# Altium schematic sheet TU_MCU.SchDoc
size 500 x 500 mm
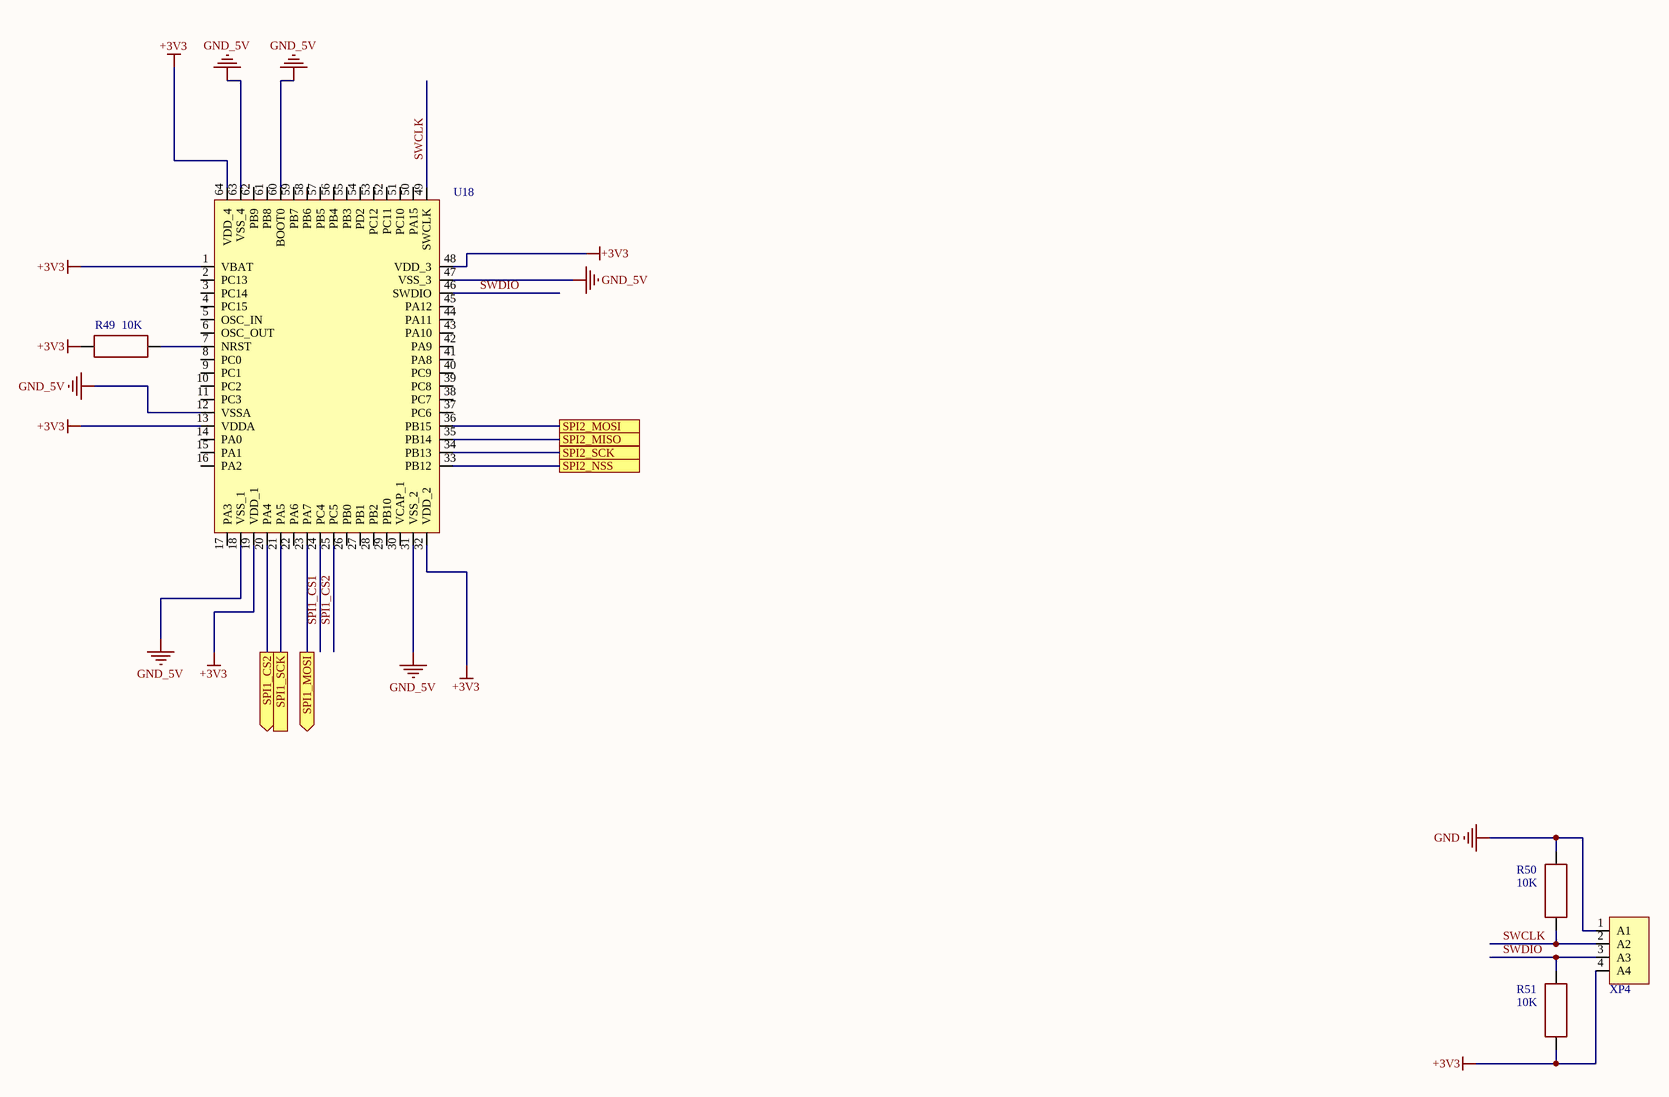
[diagram p0: TU_MCU.SchDoc]

## Parts
R49  value 10K  [RES: 0402]
R50  value 10K  [RES: 0402]
R51  value 10K  [RES: 0402]
U18  STM32F413RGT6  [LQFP-64]  (value not drawn)
XP4  PLS-6 (DS1021-1x6)  [PLS-4 (DS1021-1x4)]  (value not drawn)

## Ports
SPI1_CS2 (out), SPI1_MOSI (out), SPI1_SCK, SPI2_MISO, SPI2_MOSI, SPI2_NSS, SPI2_SCK

## Nets
+3V3: R49.1 R51.2 U18.1(VBAT) U18.13(VDDA) U18.19(VDD_1) U18.32(VDD_2) U18.48(VDD_3) U18.64(VDD_4) XP4.4(A4)
GND: R50.1 XP4.1(A1)
GND_5V: U18.12(VSSA) U18.18(VSS_1) U18.31(VSS_2) U18.47(VSS_3) U18.60(BOOT0) U18.63(VSS_4)
SPI1_CS1: U18.24(PC4)
SPI1_CS2: U18.20(PA4) ; port SPI1_CS2
SPI1_CS2: U18.25(PC5)  [a separate net that carries the same name]
SPI1_MOSI: U18.23(PA7) ; port SPI1_MOSI
SPI1_SCK: U18.21(PA5) ; port SPI1_SCK
SPI2_MISO: U18.35(PB14) ; port SPI2_MISO
SPI2_MOSI: U18.36(PB15) ; port SPI2_MOSI
SPI2_NSS: U18.33(PB12) ; port SPI2_NSS
SPI2_SCK: U18.34(PB13) ; port SPI2_SCK
SWCLK: R50.2 U18.49(SWCLK) XP4.2(A2)
SWDIO: R51.1 U18.46(SWDIO) XP4.3(A3)
NetR49_2: R49.2 U18.7(NRST)

Not connected (* = marked no-connect by the designer): U18 2(PC13) 3(PC14) 4(PC15) 5(OSC_IN) 6(OSC_OUT) 8(PC0) 9(PC1) 10(PC2) 11(PC3) 14(PA0) 15(PA1) 16(PA2) 17(PA3) 22(PA6) 26(PB0) 27(PB1) 28(PB2) 29(PB10) 30(VCAP_1) 37(PC6) 38(PC7) 39(PC8) 40(PC9) 41(PA8) 42(PA9) 43(PA10) 44(PA11) 45(PA12) 50(PA15) 51(PC10) 52(PC11) 53(PC12) 54(PD2) 55(PB3) 56(PB4) 57(PB5) 58(PB6) 59(PB7) 61(PB8) 62(PB9)

## Library data of the parts
R49-R51 = Resistor_0402: Tolerance: ±5%; Product Category: Resistors; Package/Case: 0402; Temperature: -55...+125°C
U18 = STM32F413RGT6: ARM Microcontrollers - MCU High-performance access line, Arm Cortex-M4 core DSP & FPU, 1 MByte of Flash 100; Manufacturer: STMicroelectronics; Datasheet: https://eu.mouser.com/datasheet/2/389/stm32f413cg-1851205.pdf; HelpURL: https://eu.mouser.com/ProductDetail/STMicroelectronics/STM32F413RGT6?qs=FNcb6ahWXRyREY%252BFzgYY7A%3D%3D; Package/Case: LQFP-64; Product Category: Microcontrollers
XP4 = PLS-4 (DS1021-1x4): Board to Board, Surface Mount, Single row, 6 Positions, 2.54mm, Vertical.; Manufacturer: Connfly; Datasheet: https://static.chipdip.ru/lib/977/DOC005977245.pdf; HelpURL: https://www.chipdip.by/product/pls-4; Product Category: Connectors